# Altium schematic sheet SIM7600G.SchDoc
size A2
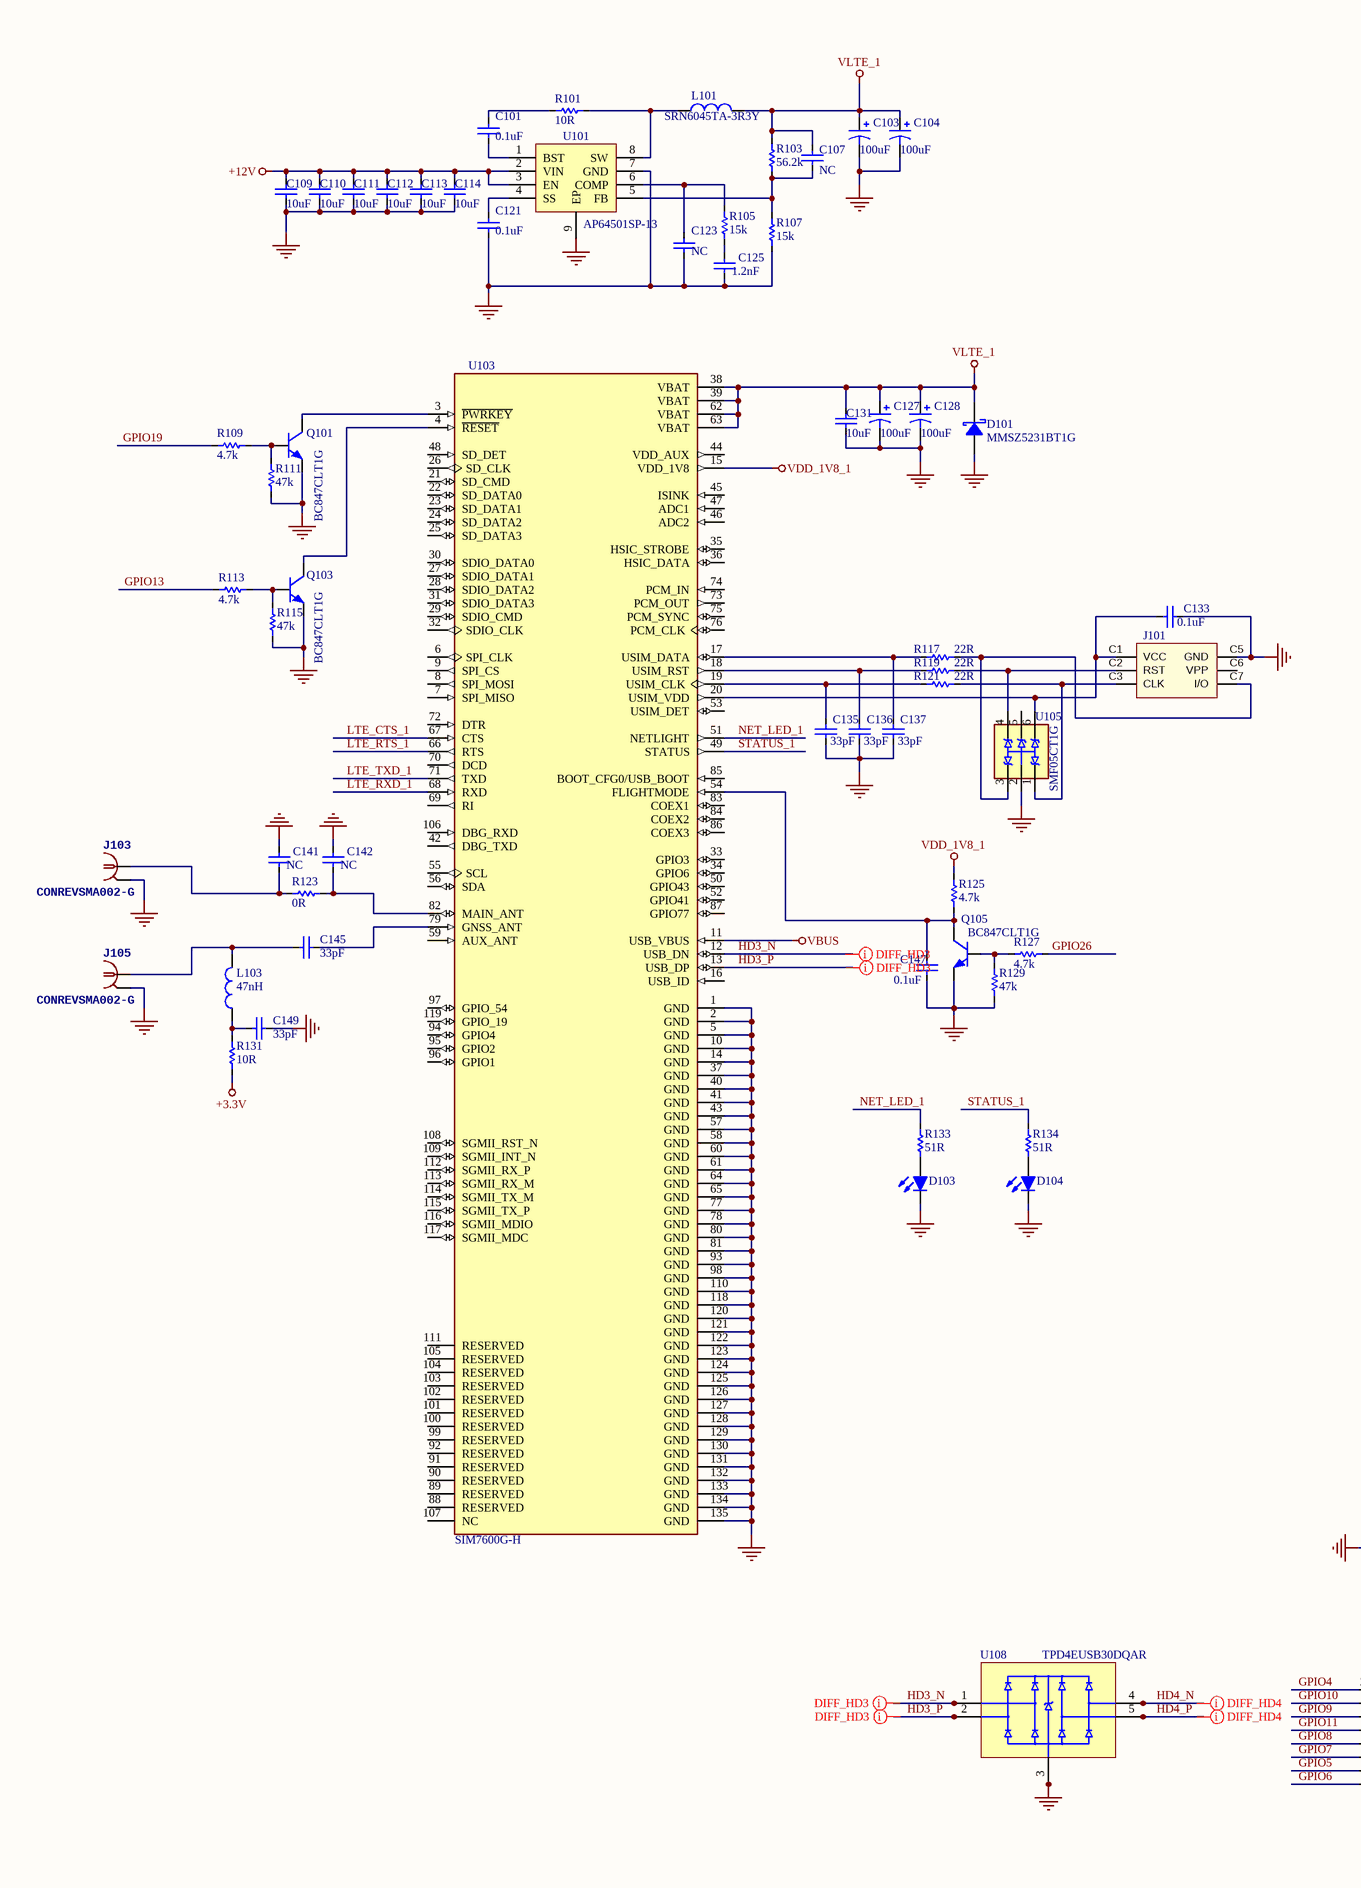
[diagram p0: SIM7600G.SchDoc, left]
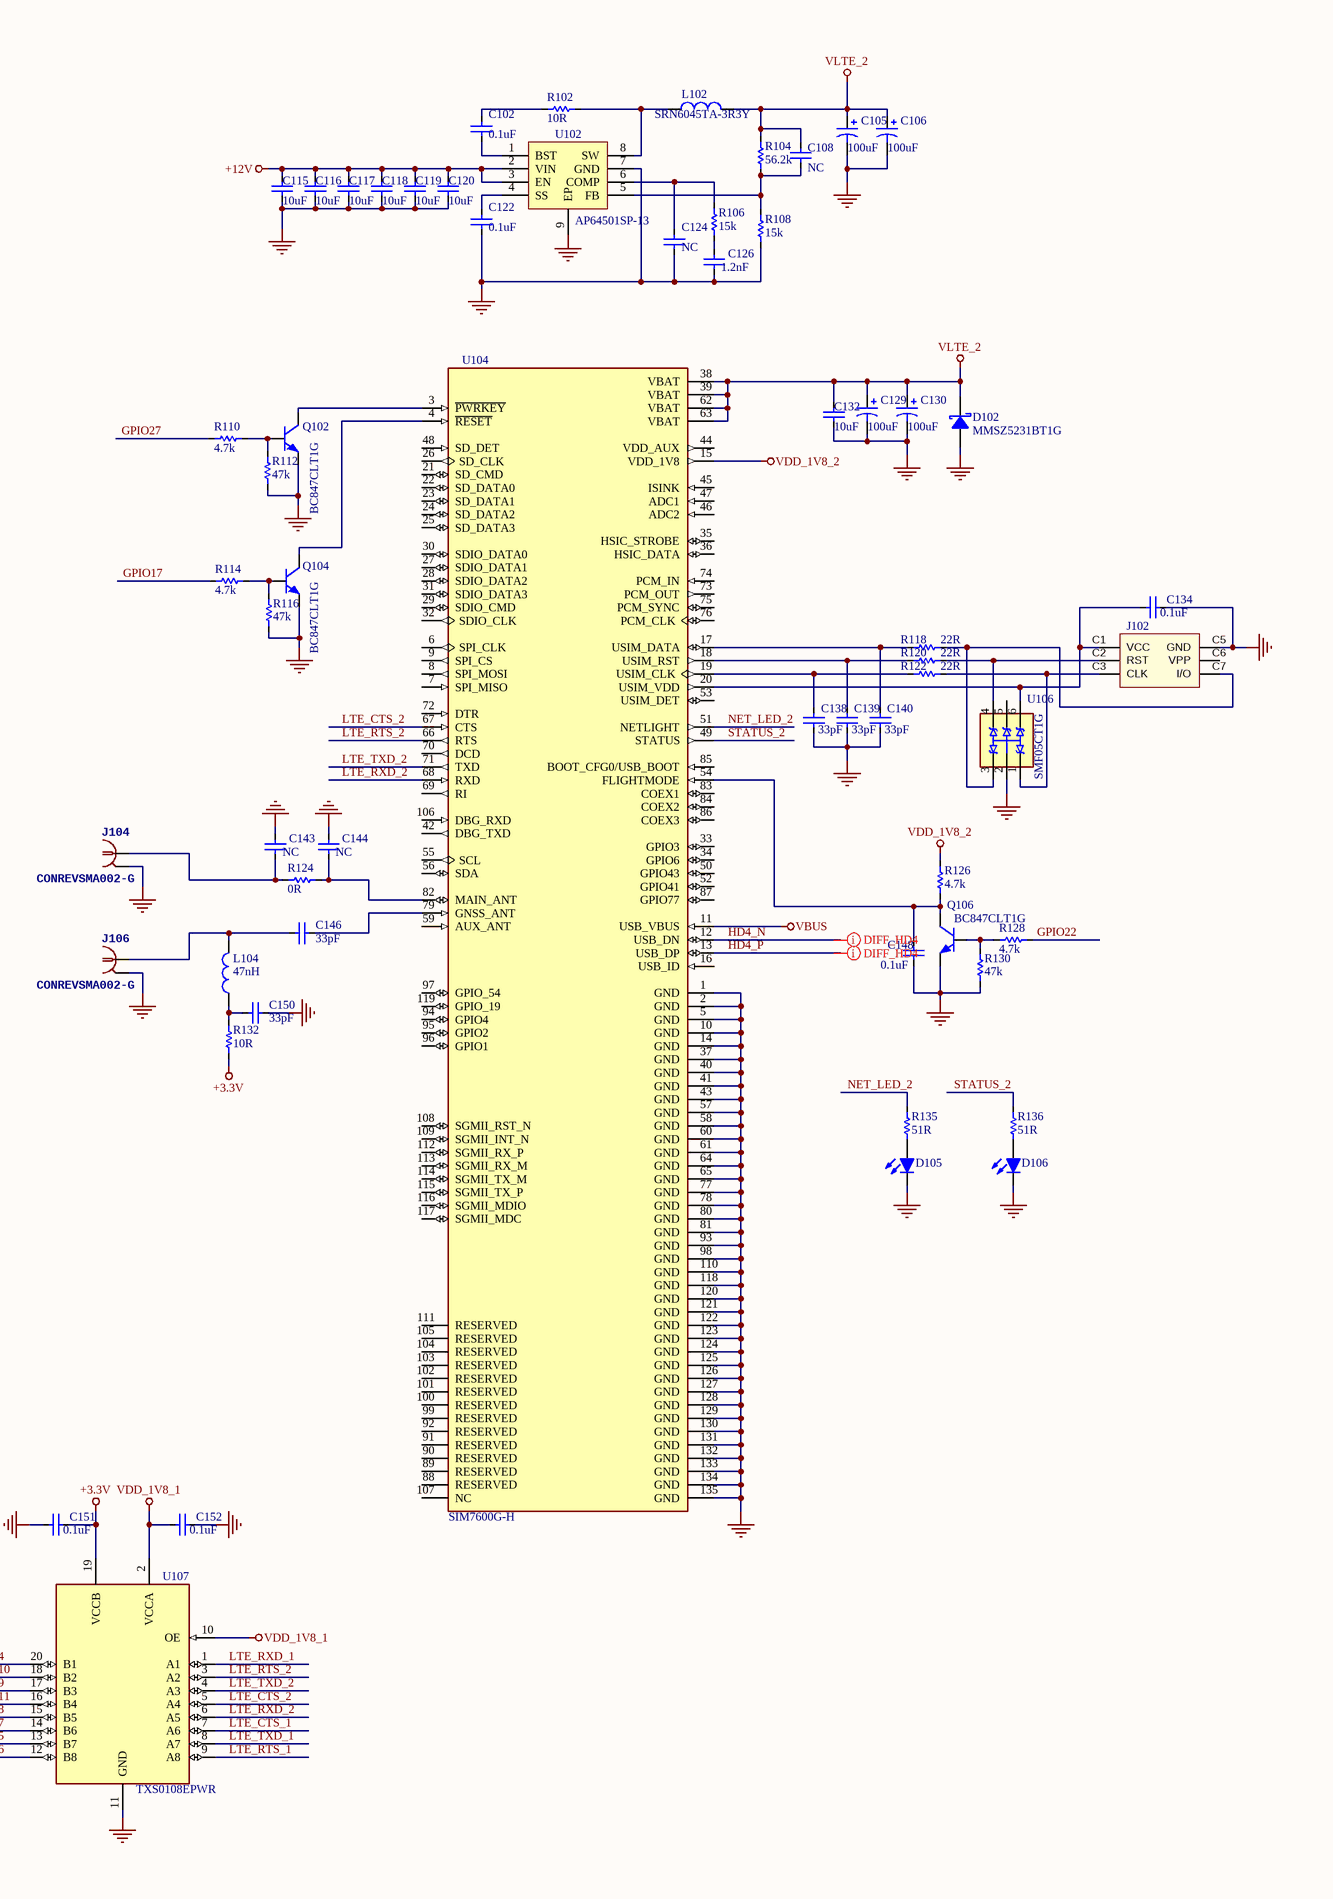
[diagram p1: SIM7600G.SchDoc, right]

## Parts
C101  0.1uF  [C_0402_1005Metric]
C102  0.1uF  [C_0402_1005Metric]
C103  100uF  [CP_EIA-7343-31_Kemet-D]
C104  100uF  [CP_EIA-7343-31_Kemet-D]
C105  100uF  [CP_EIA-7343-31_Kemet-D]
C106  100uF  [CP_EIA-7343-31_Kemet-D]
C107  NC  [C_0402_1005Metric]
C108  NC  [C_0402_1005Metric]
C109  10uF  [C_0805_2012Metric]
C110  10uF  [C_0805_2012Metric]
C111  10uF  [C_0805_2012Metric]
C112  10uF  [C_0805_2012Metric]
C113  10uF  [C_0805_2012Metric]
C114  10uF  [C_0805_2012Metric]
C115  10uF  [C_0805_2012Metric]
C116  10uF  [C_0805_2012Metric]
C117  10uF  [C_0805_2012Metric]
C118  10uF  [C_0805_2012Metric]
C119  10uF  [C_0805_2012Metric]
C120  10uF  [C_0805_2012Metric]
C121  0.1uF  [C_0402_1005Metric]
C122  0.1uF  [C_0402_1005Metric]
C123  NC  [C_0402_1005Metric]
C124  NC  [C_0402_1005Metric]
C125  1.2nF  [C_0402_1005Metric]
C126  1.2nF  [C_0402_1005Metric]
C127  100uF  [CP_EIA-7343-31_Kemet-D]
C128  100uF  [CP_EIA-7343-31_Kemet-D]
C129  100uF  [CP_EIA-7343-31_Kemet-D]
C130  100uF  [CP_EIA-7343-31_Kemet-D]
C131  10uF  [C_0805_2012Metric]
C132  10uF  [C_0805_2012Metric]
C133  0.1uF  [C_0402_1005Metric]
C134  0.1uF  [C_0402_1005Metric]
C135  33pF  [C_0402_1005Metric]
C136  33pF  [C_0402_1005Metric]
C137  33pF  [C_0402_1005Metric]
C138  33pF  [C_0402_1005Metric]
C139  33pF  [C_0402_1005Metric]
C140  33pF  [C_0402_1005Metric]
C141  NC  [C_0402_1005Metric]
C142  NC  [C_0402_1005Metric]
C143  NC  [C_0402_1005Metric]
C144  NC  [C_0402_1005Metric]
C145  33pF  [C_0402_1005Metric]
C146  33pF  [C_0402_1005Metric]
C147  0.1uF  [C_0402_1005Metric]
C148  0.1uF  [C_0402_1005Metric]
C149  33pF  [C_0402_1005Metric]
C150  33pF  [C_0402_1005Metric]
C151  0.1uF  [C_0402_1005Metric]
C152  0.1uF  [C_0402_1005Metric]
D101  MMSZ5231BT1G  [SOD-123]
D102  MMSZ5231BT1G  [SOD-123]
D103  SML-D12M8WT86  [LED_0603_1608Metric]  (value not drawn)
D104  SML-D12M8WT86  [LED_0603_1608Metric]  (value not drawn)
D105  SML-D12M8WT86  [LED_0603_1608Metric]  (value not drawn)
D106  SML-D12M8WT86  [LED_0603_1608Metric]  (value not drawn)
J101  78646-3001  [78646-3001]  (value not drawn)
J102  78646-3001  [78646-3001]  (value not drawn)
J103  CONREVSMA002-G  [LINX_CONREVSMA002-G]
J104  CONREVSMA002-G  [LINX_CONREVSMA002-G]
J105  CONREVSMA002-G  [LINX_CONREVSMA002-G]
J106  CONREVSMA002-G  [LINX_CONREVSMA002-G]
L101  SRN6045TA-3R3Y  [L_Bourns_SRN6045TA]
L102  SRN6045TA-3R3Y  [L_Bourns_SRN6045TA]
L103  47nH  [SMD_R(0402)]
L104  47nH  [SMD_R(0402)]
Q101  BC847CLT1G  [SOT23-3]
Q102  BC847CLT1G  [SOT23-3]
Q103  BC847CLT1G  [SOT23-3]
Q104  BC847CLT1G  [SOT23-3]
Q105  BC847CLT1G  [SOT23-3]
Q106  BC847CLT1G  [SOT23-3]
R101  10R  [R_0402_1005Metric]
R102  10R  [R_0402_1005Metric]
R103  56.2k  [R_0402_1005Metric]
R104  56.2k  [R_0402_1005Metric]
R105  15k  [R_0402_1005Metric]
R106  15k  [R_0402_1005Metric]
R107  15k  [R_0402_1005Metric]
R108  15k  [R_0402_1005Metric]
R109  4.7k  [R_0402_1005Metric]
R110  4.7k  [R_0402_1005Metric]
R111  47k  [R_0402_1005Metric]
R112  47k  [R_0402_1005Metric]
R113  4.7k  [R_0402_1005Metric]
R114  4.7k  [R_0402_1005Metric]
R115  47k  [R_0402_1005Metric]
R116  47k  [R_0402_1005Metric]
R117  22R  [R_0402_1005Metric]
R118  22R  [R_0402_1005Metric]
R119  22R  [R_0402_1005Metric]
R120  22R  [R_0402_1005Metric]
R121  22R  [R_0402_1005Metric]
R122  22R  [R_0402_1005Metric]
R123  0R  [R_0402_1005Metric]
R124  0R  [R_0402_1005Metric]
R125  4.7k  [R_0402_1005Metric]
R126  4.7k  [R_0402_1005Metric]
R127  4.7k  [R_0402_1005Metric]
R128  4.7k  [R_0402_1005Metric]
R129  47k  [R_0402_1005Metric]
R130  47k  [R_0402_1005Metric]
R131  10R  [R_0402_1005Metric]
R132  10R  [R_0402_1005Metric]
R133  51R  [R_0402_1005Metric]
R134  51R  [R_0402_1005Metric]
R135  51R  [R_0402_1005Metric]
R136  51R  [R_0402_1005Metric]
U101  AP64501SP-13  [SOIC-8-1EP_3.9x4.9mm_P1.27mm_EP2.95x4.9mm_Mask2.71x3.4mm_ThermalVias]
U102  AP64501SP-13  [SOIC-8-1EP_3.9x4.9mm_P1.27mm_EP2.95x4.9mm_Mask2.71x3.4mm_ThermalVias]
U103  SIM7600G-H  [IC_SIM7600G]
U104  SIM7600G-H  [IC_SIM7600G]
U105  SMF05CT1G  [SOT-363]
U106  SMF05CT1G  [SOT-363]
U107  TXS0108EPWR  [SOP65P640X120-20N]
U108  TPD4EUSB30DQAR  [USON-10_2.5x1.0mm_P0.5mm]

## Nets
+3.3V: C151.2 R131.1 R132.1 U107.19(VCCB)
+12V: C109.1 C110.1 C111.1 C112.1 C113.1 C114.1 C115.1 C116.1 C117.1 C118.1 C119.1 C120.1 U101.2(VIN) U101.3(EN) U102.2(VIN) U102.3(EN)
GND: C103.2 C104.2 C105.2 C106.2 C109.2 C110.2 C111.2 C112.2 C113.2 C114.2 C115.2 C116.2 C117.2 C118.2 C119.2 C120.2 C121.2 C122.2 C123.2 C124.2 C125.2 C126.2 C127.2 C128.2 C129.2 C130.2 C131.2 C132.2 C133.2 C134.2 C135.1 C136.1 C137.1 C138.1 C139.1 C140.1 C141.1 C142.1 C143.1 C144.1 C147.1 C148.1 C149.1 C150.1 C151.1 C152.2 D101.A D102.A D103.1(K) D104.1(K) D105.1(K) D106.1(K) J101.C5(GND) J102.C5(GND) J103.2(GND) J104.2(GND) J105.2(GND) J106.2(GND) Q101.2(E) Q102.2(E) Q103.2(E) Q104.2(E) Q105.2(E) Q106.2(E) R107.2 R108.2 R111.1 R112.1 R115.1 R116.1 R129.1 R130.1 U101.7(GND) U101.9(EP) U102.7(GND) U102.9(EP) U103.1(GND) U103.2(GND) U103.5(GND) U103.10(GND) U103.14(GND) U103.37(GND) U103.40(GND) U103.41(GND) U103.43(GND) U103.57(GND) U103.58(GND) U103.60(GND) U103.61(GND) U103.64(GND) U103.65(GND) U103.77(GND) U103.78(GND) U103.80(GND) U103.81(GND) U103.93(GND) U103.98(GND) U103.110(GND) U103.118(GND) U103.120(GND) U103.121(GND) U103.122(GND) U103.123(GND) U103.124(GND) U103.125(GND) U103.126(GND) U103.127(GND) U103.128(GND) U103.129(GND) U103.130(GND) U103.131(GND) U103.132(GND) U103.133(GND) U103.134(GND) U103.135(GND) U104.1(GND) U104.2(GND) U104.5(GND) U104.10(GND) U104.14(GND) U104.37(GND) U104.40(GND) U104.41(GND) U104.43(GND) U104.57(GND) U104.58(GND) U104.60(GND) U104.61(GND) U104.64(GND) U104.65(GND) U104.77(GND) U104.78(GND) U104.80(GND) U104.81(GND) U104.93(GND) U104.98(GND) U104.110(GND) U104.118(GND) U104.120(GND) U104.121(GND) U104.122(GND) U104.123(GND) U104.124(GND) U104.125(GND) U104.126(GND) U104.127(GND) U104.128(GND) U104.129(GND) U104.130(GND) U104.131(GND) U104.132(GND) U104.133(GND) U104.134(GND) U104.135(GND) U105.2(A) U106.2(A) U107.11(GND) U108.3(GND_3) U108.8(GND_8)
VBUS: U103.11(USB_VBUS) U104.11(USB_VBUS)
VDD_1V8_1: C152.1 R125.1 U103.15(VDD_1V8) U107.2(VCCA) U107.10(OE)
VDD_1V8_2: R126.1 U104.15(VDD_1V8)
VLTE_1: C103.1 C104.1 C107.1 C127.1 C128.1 C131.1 D101.K L101.2 R103.1 U103.38(VBAT) U103.39(VBAT) U103.62(VBAT) U103.63(VBAT)
VLTE_2: C105.1 C106.1 C108.1 C129.1 C130.1 C132.1 D102.K L102.2 R104.1 U104.38(VBAT) U104.39(VBAT) U104.62(VBAT) U104.63(VBAT)
GPIO4: U107.20(B1)
GPIO5: U107.13(B7)
GPIO6: U107.12(B8)
GPIO7: U107.14(B6)
GPIO8: U107.15(B5)
GPIO9: U107.17(B3)
GPIO10: U107.18(B2)
GPIO11: U107.16(B4)
GPIO13: R113.2
GPIO17: R114.2
GPIO19: R109.2
GPIO22: R128.1
GPIO26: R127.1
GPIO27: R110.2
HD3_N: U103.12(USB_DN) U108.1(D1+) U108.10(NC_10)
HD3_P: U103.13(USB_DP) U108.2(D1-) U108.9(NC_9)
HD4_N: U104.12(USB_DN) U108.4(D2+) U108.7(NC_7)
HD4_P: U104.13(USB_DP) U108.5(D2-) U108.6(NC_6)
LTE_CTS_1: U103.67(CTS) U107.7(A6)
LTE_CTS_2: U104.67(CTS) U107.5(A4)
LTE_RTS_1: U103.66(RTS) U107.9(A8)
LTE_RTS_2: U104.66(RTS) U107.3(A2)
LTE_RXD_1: U103.68(RXD) U107.1(A1)
LTE_RXD_2: U104.68(RXD) U107.6(A5)
LTE_TXD_1: U103.71(TXD) U107.8(A7)
LTE_TXD_2: U104.71(TXD) U107.4(A3)
NET_LED_1: R133.1 U103.51(NETLIGHT)
NET_LED_2: R135.1 U104.51(NETLIGHT)
STATUS_1: R134.1 U103.49(STATUS)
STATUS_2: R136.1 U104.49(STATUS)
NetC101_1: C101.1 R101.2
NetC101_2: C101.2 U101.1(BST)
NetC102_1: C102.1 R102.2
NetC102_2: C102.2 U102.1(BST)
NetC107_2: C107.2 R103.2 R107.1 U101.5(FB)
NetC108_2: C108.2 R104.2 R108.1 U102.5(FB)
NetC121_1: C121.1 U101.4(SS)
NetC122_1: C122.1 U102.4(SS)
NetC123_1: C123.1 R105.1 U101.6(COMP)
NetC124_1: C124.1 R106.1 U102.6(COMP)
NetC125_1: C125.1 R105.2
NetC126_1: C126.1 R106.2
NetC133_1: C133.1 J101.C1(VCC) U103.20(USIM_VDD) U105.6(C5)
NetC134_1: C134.1 J102.C1(VCC) U104.20(USIM_VDD) U106.6(C5)
NetC135_2: C135.2 R121.1 U103.19(USIM_CLK)
NetC136_2: C136.2 R119.1 U103.18(USIM_RST)
NetC137_2: C137.2 R117.1 U103.17(USIM_DATA)
NetC138_2: C138.2 R122.1 U104.19(USIM_CLK)
NetC139_2: C139.2 R120.1 U104.18(USIM_RST)
NetC140_2: C140.2 R118.1 U104.17(USIM_DATA)
NetC141_2: C141.2 J103.1 R123.1
NetC142_2: C142.2 R123.2 U103.82(MAIN_ANT)
NetC143_2: C143.2 J104.1 R124.1
NetC144_2: C144.2 R124.2 U104.82(MAIN_ANT)
NetC145_1: C145.1 U103.79(GNSS_ANT)
NetC145_2: C145.2 J105.1 L103.2
NetC146_1: C146.1 U104.79(GNSS_ANT)
NetC146_2: C146.2 J106.1 L104.2
NetC147_2: C147.2 Q105.3(C) R125.2 U103.54(FLIGHTMODE)
NetC148_2: C148.2 Q106.3(C) R126.2 U104.54(FLIGHTMODE)
NetC149_2: C149.2 L103.1 R131.2
NetC150_2: C150.2 L104.1 R132.2
NetD103_2: D103.2(A) R133.2
NetD104_2: D104.2(A) R134.2
NetD105_2: D105.2(A) R135.2
NetD106_2: D106.2(A) R136.2
NetJ101_C2: J101.C2(RST) R119.2 U105.4(C3)
NetJ101_C3: J101.C3(CLK) R121.2 U105.1(C1)
NetJ101_C7: J101.C7(I/O) R117.2 U105.3(C2)
NetJ102_C2: J102.C2(RST) R120.2 U106.4(C3)
NetJ102_C3: J102.C3(CLK) R122.2 U106.1(C1)
NetJ102_C7: J102.C7(I/O) R118.2 U106.3(C2)
NetL101_1: L101.1 R101.1 U101.8(SW)
NetL102_1: L102.1 R102.1 U102.8(SW)
NetQ101_1: Q101.1(B) R109.1 R111.2
NetQ101_3: Q101.3(C) U103.3(~{PWRKEY})
NetQ102_1: Q102.1(B) R110.1 R112.2
NetQ102_3: Q102.3(C) U104.3(~{PWRKEY})
NetQ103_1: Q103.1(B) R113.1 R115.2
NetQ103_3: Q103.3(C) U103.4(~{RESET})
NetQ104_1: Q104.1(B) R114.1 R116.2
NetQ104_3: Q104.3(C) U104.4(~{RESET})
NetQ105_1: Q105.1(B) R127.2 R129.2
NetQ106_1: Q106.1(B) R128.2 R130.2

Not connected (* = marked no-connect by the designer): J101 C6(VPP); J102 C6(VPP); U103 6(SPI_CLK) 7(SPI_MISO) 8(SPI_MOSI) 9(SPI_CS) 16(USB_ID) 21(SD_CMD) 22(SD_DATA0) 23(SD_DATA1) 24(SD_DATA2) 25(SD_DATA3) 26(SD_CLK) 27(SDIO_DATA1) 28(SDIO_DATA2) 29(SDIO_CMD) 30(SDIO_DATA0) 31(SDIO_DATA3) 32(SDIO_CLK) 33(GPIO3) 34(GPIO6) 35(HSIC_STROBE) 36(HSIC_DATA) 42(DBG_TXD) 44(VDD_AUX) 45(ISINK) 46(ADC2) 47(ADC1) 48(SD_DET) 50(GPIO43) 52(GPIO41) 53(USIM_DET) 55(SCL) 56(SDA) 59(AUX_ANT) 69(RI) 70(DCD) 72(DTR) 73(PCM_OUT) 74(PCM_IN) 75(PCM_SYNC) 76(PCM_CLK) 83(COEX1) 84(COEX2) 85(BOOT_CFG0/USB_BOOT) 86(COEX3) 87(GPIO77) 88(RESERVED) 89(RESERVED) 90(RESERVED) 91(RESERVED) 92(RESERVED) 94(GPIO4) 95(GPIO2) 96(GPIO1) 97(GPIO_54) 99(RESERVED) 100(RESERVED) 101(RESERVED) 102(RESERVED) 103(RESERVED) 104(RESERVED) 105(RESERVED) 106(DBG_RXD) 107(NC) 108(SGMII_RST_N) 109(SGMII_INT_N) 111(RESERVED) 112(SGMII_RX_P) 113(SGMII_RX_M) 114(SGMII_TX_M) 115(SGMII_TX_P) 116(SGMII_MDIO) 117(SGMII_MDC) 119(GPIO_19); U104 6(SPI_CLK) 7(SPI_MISO) 8(SPI_MOSI) 9(SPI_CS) 16(USB_ID) 21(SD_CMD) 22(SD_DATA0) 23(SD_DATA1) 24(SD_DATA2) 25(SD_DATA3) 26(SD_CLK) 27(SDIO_DATA1) 28(SDIO_DATA2) 29(SDIO_CMD) 30(SDIO_DATA0) 31(SDIO_DATA3) 32(SDIO_CLK) 33(GPIO3) 34(GPIO6) 35(HSIC_STROBE) 36(HSIC_DATA) 42(DBG_TXD) 44(VDD_AUX) 45(ISINK) 46(ADC2) 47(ADC1) 48(SD_DET) 50(GPIO43) 52(GPIO41) 53(USIM_DET) 55(SCL) 56(SDA) 59(AUX_ANT) 69(RI) 70(DCD) 72(DTR) 73(PCM_OUT) 74(PCM_IN) 75(PCM_SYNC) 76(PCM_CLK) 83(COEX1) 84(COEX2) 85(BOOT_CFG0/USB_BOOT) 86(COEX3) 87(GPIO77) 88(RESERVED) 89(RESERVED) 90(RESERVED) 91(RESERVED) 92(RESERVED) 94(GPIO4) 95(GPIO2) 96(GPIO1) 97(GPIO_54) 99(RESERVED) 100(RESERVED) 101(RESERVED) 102(RESERVED) 103(RESERVED) 104(RESERVED) 105(RESERVED) 106(DBG_RXD) 107(NC) 108(SGMII_RST_N) 109(SGMII_INT_N) 111(RESERVED) 112(SGMII_RX_P) 113(SGMII_RX_M) 114(SGMII_TX_M) 115(SGMII_TX_P) 116(SGMII_MDIO) 117(SGMII_MDC) 119(GPIO_19); U105 5(C4); U106 5(C4)

## Layout directives
differential pair; differential pair class DIFF_100Ohm_HD3; differential pair class DIFF_HD3; net class HD3: HD3_N, HD3_P
differential pair; differential pair class DIFF_100Ohm_HD4; differential pair class DIFF_HD4; net class HD4: HD4_N, HD4_P

## Library data of the parts
C101 C102 C121 C122 C133 C134 C147 C148 C151 C152 = Cap: 0.1µF ±10% 50V; Manufacturer: Yageo; Manufacturer Part Number: CC0402KRX5R9BB104; Supplier: Digi-Key; Supplier Part Number: 311-3342-1-ND; Value: 0.1uF
C103-C106 C127-C130 = Cap Pol1: CAP TANT 100UF 20% 10V 2917; Manufacturer Part Number: TAJD107M010RNJ; Manufacturer: AVX Corporation; Supplier: Digi-Key; Supplier Part Number: 478-3918-1-ND; Value: 100uF
C107 C108 C123 C124 C141-C144 = Cap: Value: NC
C109-C120 C131 C132 = Cap: 10µF ±10% 35V; Manufacturer: Murata; Manufacturer Part Number: GRM21BR6YA106KE43L; Supplier: Digi-Key; Supplier Part Number: 490-10514-1-ND; Vaule: 10uF
C125 C126 = Cap: 1200pF ±10% 50V; Manufacturer: Yageo; Manufacturer Part Number: GRM155R71H122KA01J; Supplier: Digi-Key; Supplier Part Number: 490-6352-1-ND; Value: 1.2nF
C135-C140 C145 C146 C149 C150 = Cap: 33pF ±1% 50V; Manufacturer: Yageo; Manufacturer Part Number: CC0402FRNPO9BN330; Supplier: Digi-Key; Supplier Part Number: 311-3732-1-ND; Value: 33pF
D101 D102 = Diode 10TQ035: DIODE ZENER 5.1V 500MW SOD123; Manufacturer: ON Semiconductor; Value: MMSZ5231BT1G; Supplier: Digi-Key; Supplier Part Number: MMSZ5231BT1GOSCT-ND; Manufacturer Part Number: MMSZ5231BT1G
D103-D106 = LED1: LED GREEN DIFFUSED 0603 SMD; Manufacturer: Rohm Semiconductor; Supplier: Digi-Key; Supplier Part Number: 511-1578-1-ND; Manufacturer Part Number: SML-D12M8WT86; Value: SML-D12M8WT86
J101 J102 = CN SimCard_63: CONN MICRO SIM CARD PUSH-PULL; Manufacturer: Molex; Value: 78646-3001; Manufacturer Part Number: 78646-3001; Supplier Part Number: 538-78646-3001; Supplier: Mouser
J103-J106 = SMA-SMD: CONN SMA JACK STR EDGE MNT; Manufacturer: Linx Technologies Inc.; Manufacturer Part Number: CONREVSMA002-G; Supplier: Digi-Key; Supplier Part Number: CONREVSMA002-G-ND; Value: CONREVSMA002-G
L101 L102 = Inductor: FIXED IND 3.3UH 5A 21 MOHM SMD; Manufacturer: Bourns Inc.; Manufacturer Part Number: SRN6045TA-3R3Y; Value: SRN6045TA-3R3Y; Supplier: Digi-Key; Supplier Part Number: SRN6045TA-3R3YCT-ND
L103 L104 = Inductor: FIXED IND 47NH 210MA 1.08 OHM; Manufacturer Part Number: LQW15AN47NJ00D; Manufacturer: Murata; Value: 47nH; Supplier: Digi-Key; Supplier Part Number: 490-1154-1-ND
Q101-Q106 = 2N3904: TRANS NPN 45V 100MA SOT23-3; Manufacturer: ON Semiconductor; Supplier: Digi-Key; Manufacturer Part Number: BC847CLT1G; Supplier Part Number: BC847CLT1GOSCT-ND; Value: BC847CLT1G
R101 R102 R131 R132 = Res Semi: 10 Ohms ±1% 0.063W; Manufacturer: Yageo; Manufacturer Part Number: RC0402FR-0710RL; Value: 10R; Supplier: Digi-Key; Supplier Part Number: 311-10.0LRCT-ND
R103 R104 = Res Semi: 56.2 kOhms ±1% 0.063W; Manufacturer: Yageo; Manufacturer Part Number: RC0402FR-0756K2L; Value: 56.2k; Supplier: Digi-Key; Supplier Part Number: YAG3187CT-ND
R105-R108 = Res Semi: 15 kOhms ±1% 0.063W; Manufacturer: Yageo; Manufacturer Part Number: RC0402FR-0715KL; Value: 15k; Supplier: Digi-Key; Supplier Part Number: 311-15.0KLRCT-ND
R109 R110 R113 R114 R125-R128 = Res Semi: 4.7 kOhms ±1% 0.063W; Manufacturer: Yageo; Manufacturer Part Number: RC0402FR-074K7L; Value: 4.7k; Supplier: Digi-Key; Supplier Part Number: 311-4.7KLRCT-ND
R111 R112 R115 R116 R129 R130 = Res Semi: 47 kOhms ±1% 0.063W; Manufacturer: Yageo; Manufacturer Part Number: RC0402FR-0747KL; Value: 47k; Supplier: Digi-Key; Supplier Part Number: 311-47.0KLRCT-ND
R117-R122 = Res Semi: 22 Ohms ±1% 0.063W; Manufacturer: Yageo; Manufacturer Part Number: RC0402FR-0722RL; Value: 22R; Supplier: Digi-Key; Supplier Part Number: 311-22.0LRCT-ND
R123 R124 = Res Semi: 0 Ohms Jumper 0.063W; Manufacturer: Yageo; Manufacturer Part Number: RC0402FR-070RL; Value: 0R; Supplier: Digi-Key; Supplier Part Number: 311-0.0LRCT-ND
R133-R136 = Res Semi: 51 Ohms ±1% 0.063W; Manufacturer: Yageo; Manufacturer Part Number: RC0402FR-0751RL; Value: 51R; Supplier: Digi-Key; Supplier Part Number: 311-51.0LRCT-ND
U101 U102 = AP64501SP-13: DCDC CONV HV BUCK SO-8EP; Manufacturer: Diodes Incorporated; Manufacturer Part Number: AP64501SP-13; Supplier: Digi-Key; Supplier Part Number: 31-AP64501SP-13CT-ND; Value: AP64501SP-13
U103 U104 = SIM7600G: LTE Cat-4 Module; Manufacturer: Simcom; Value: SIM7600G-H; Manufacturer Part Number: SIM7600G-H; Supplier: Any
U105 U106 = SMF05CT1G: TRANS VOLTAGE SUPPRESSOR DIODE,; Manufacturer: ON Semiconductor; Manufacturer Part Number: SMF05CT1G; Value: SMF05CT1G; Supplier: Mouser; Supplier Part Number: 863-SMF05CT1G
U107 = TXS0108EPWR: 8-Bit Bidirectional Voltage-Level Shifter For Open-Drain And Push-Pull Application; Manufacturer: Texas Instruments; Value: TXS0108EPWR; Manufacturer Part Number: TXS0108EPWR; Supplier: Digi-Key; Supplier Part Number: 296-23011-1-ND
U108 = TPD4EUSB30DQAR: TVS DIODE 5.5V 8V 10USON; MF: Texas Instruments; Supplier Part Number: 296-28063-1-ND; Supplier: Digi-Key; MP: TPD4EUSB30DQAR; Value: TPD4EUSB30DQAR